# EAGLE design eled02 (EAGLE 7.2.0)
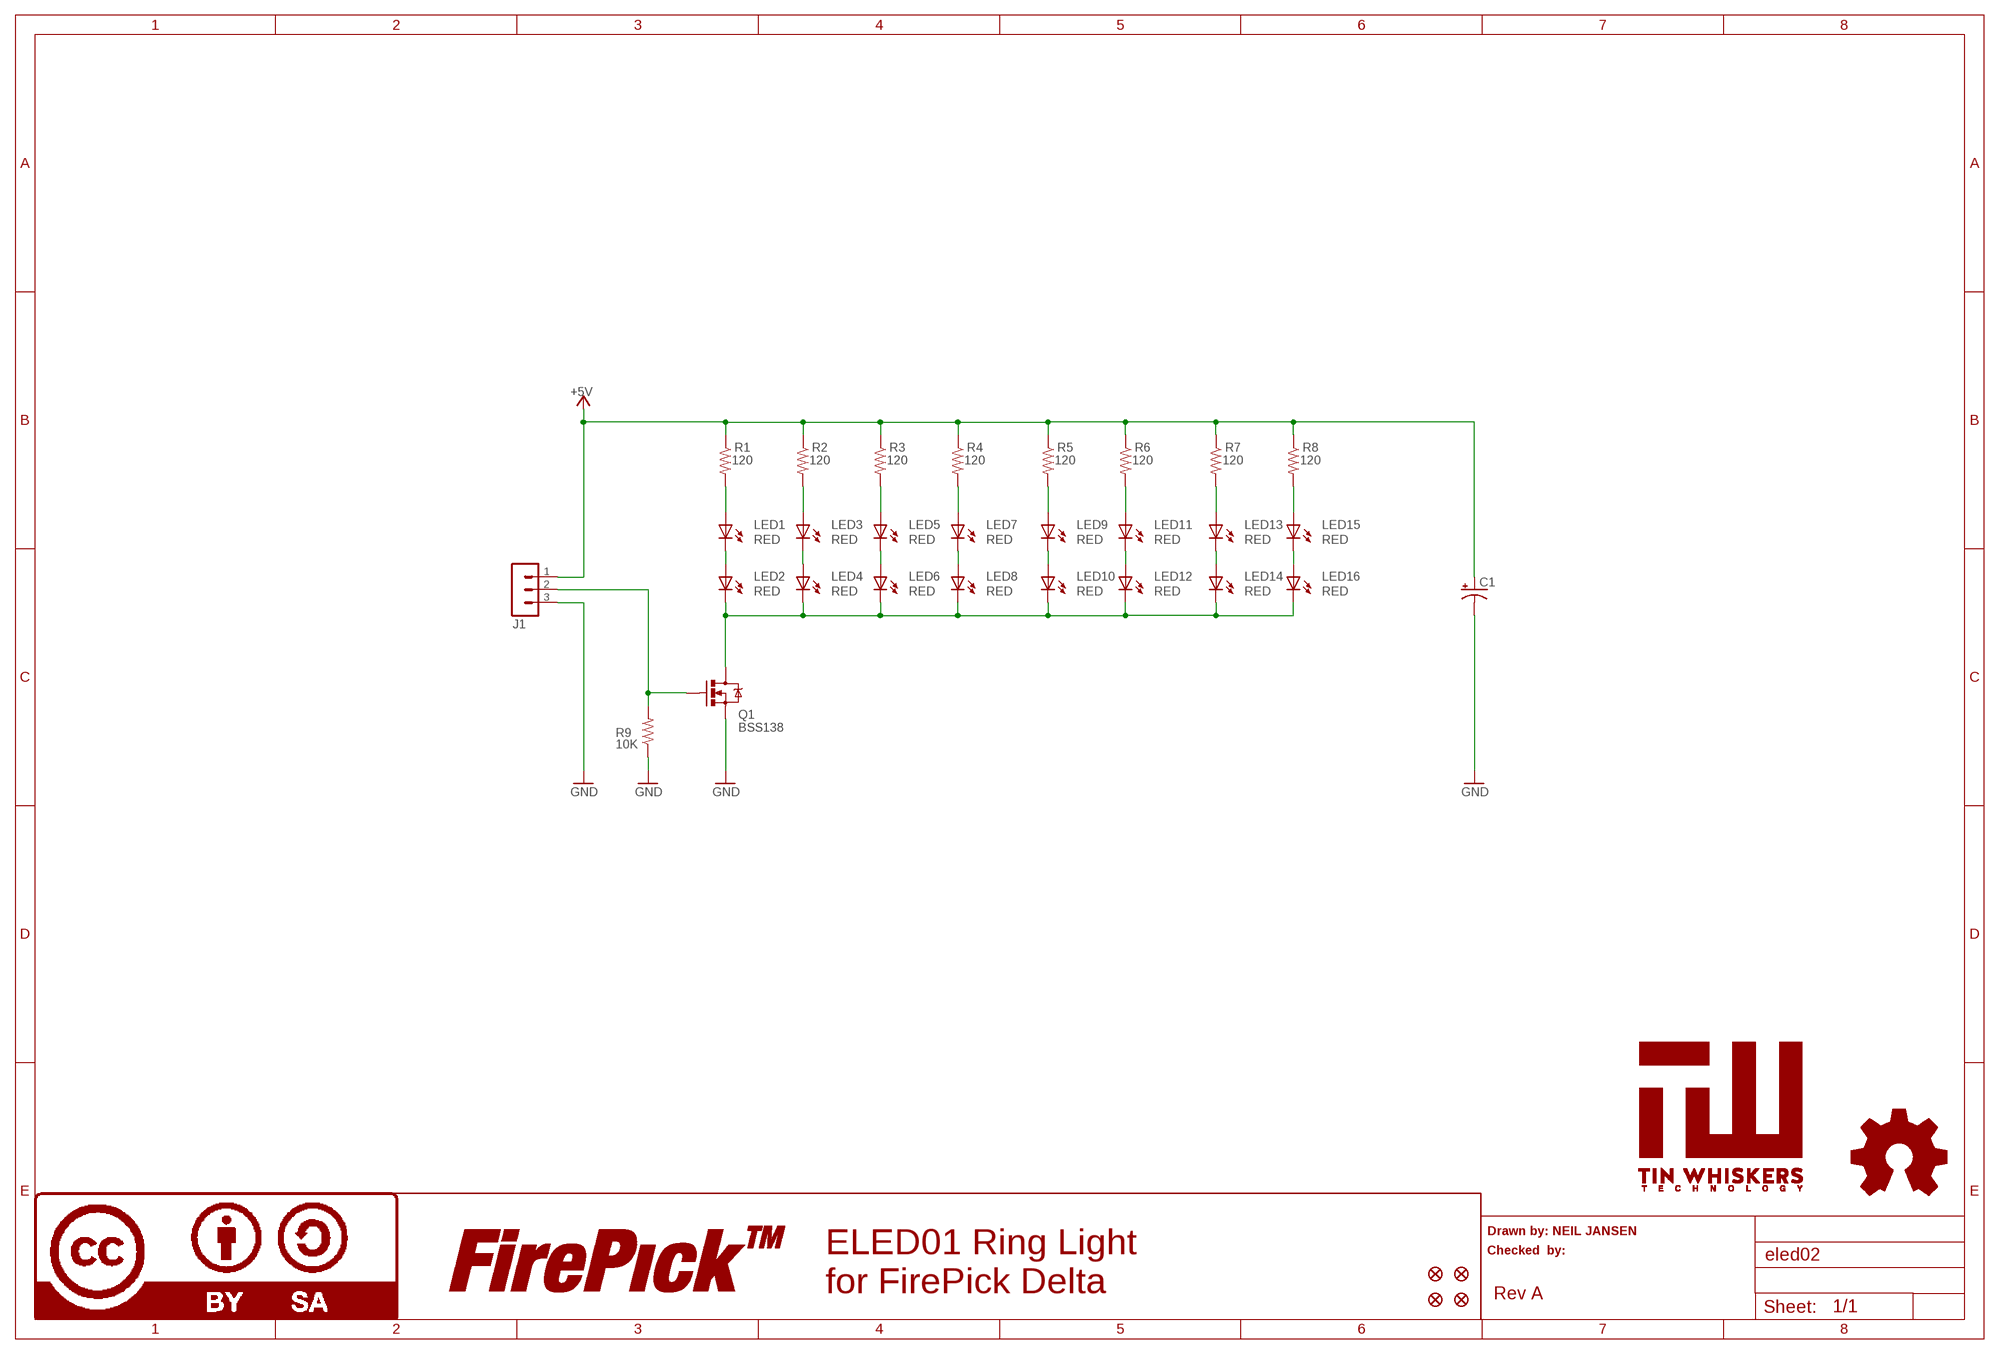
[diagram p0: schematic, sheet 1]

## Parts
C1  10UF-25V-20%(PTH)  [CPOL-RADIAL-10UF-25V]
FID1  FIDUCIAL1X2  [FIDUCIAL-1X2]
FID2  FIDUCIAL1X2  [FIDUCIAL-1X2]
FID3  FIDUCIAL1X2  [FIDUCIAL-1X2]
FID4  FIDUCIAL1X2  [FIDUCIAL-1X2]
J1  MA03-1  [MA03-1]
LED1  RED  LED1206-NS  [LED-1206-NO_SILK]
LED2  RED  LED1206-NS  [LED-1206-NO_SILK]
LED3  RED  LED1206-NS  [LED-1206-NO_SILK]
LED4  RED  LED1206-NS  [LED-1206-NO_SILK]
LED5  RED  LED1206-NS  [LED-1206-NO_SILK]
LED6  RED  LED1206-NS  [LED-1206-NO_SILK]
LED7  RED  LED1206-NS  [LED-1206-NO_SILK]
LED8  RED  LED1206-NS  [LED-1206-NO_SILK]
LED9  RED  LED1206-NS  [LED-1206-NO_SILK]
LED10  RED  LED1206-NS  [LED-1206-NO_SILK]
LED11  RED  LED1206-NS  [LED-1206-NO_SILK]
LED12  RED  LED1206-NS  [LED-1206-NO_SILK]
LED13  RED  LED1206-NS  [LED-1206-NO_SILK]
LED14  RED  LED1206-NS  [LED-1206-NO_SILK]
LED15  RED  LED1206-NS  [LED-1206-NO_SILK]
LED16  RED  LED1206-NS  [LED-1206-NO_SILK]
LOGO4  LOGO-FIREPICKMEDIUM  [LOGO-FIREPICK-MEDIUM]
LOGO5  LOGO-OSHWSMALL  [LOGO-OSHW-SMALL]
LOGO6  LOGO-CC-BY-SAMEDIUM  [LOGO-CC-BY-SA-MEDIUM]
Q1  BSS138  MOSFET-NCHANNELBSS138  [SOT23]
R1  120  RESISTOR0805-RES  [0805]
R2  120  RESISTOR0805-RES  [0805]
R3  120  RESISTOR0805-RES  [0805]
R4  120  RESISTOR0805-RES  [0805]
R5  120  RESISTOR0805-RES  [0805]
R6  120  RESISTOR0805-RES  [0805]
R7  120  RESISTOR0805-RES  [0805]
R8  120  RESISTOR0805-RES  [0805]
R9  10K  RESISTOR0805-RES  [0805]
U$1  TIN-WHISKERSSMALL  [TIN-WHISKERS-SMALL]

## Nets
+5V [power]: C1.1(+) J1.1 R1.1 R2.1 R3.1 R4.1 R5.1 R6.1 R7.1 R8.1
DRAIN: LED2.C LED4.C LED6.C LED8.C LED10.C LED12.C LED14.C LED16.C Q1.3(D)
ENABLE1: J1.2 Q1.1(G) R9.2
GND [power]: C1.2(-) J1.3 Q1.2(S) R9.1
N$1: LED1.C LED2.A
N$3: LED3.C LED4.A
N$4: LED7.C LED8.A
N$6: LED7.A R4.2
N$7: LED3.A R2.2
N$8: LED5.A R3.2
N$9: LED9.A R5.2
N$11: LED11.A R6.2
N$12: LED9.C LED10.A
N$13: LED5.C LED6.A
N$14: LED11.C LED12.A
N$17: LED13.C LED14.A
N$19: LED15.C LED16.A
N$20: LED13.A R7.2
N$21: LED15.A R8.2
N$22: LED1.A R1.2

## Notes on the sheet
- Drawn by: NEIL JANSEN
- Checked  by:
- ELED01 Ring Light
  for FirePick Delta
- Rev A

## Library data of the parts
C1 = SparkFun-Capacitors:10UF-25V-20%(PTH): CAP-08440; PROD_ID: CAP-08440
FID1-FID4 = SparkFun-Aesthetics:FIDUCIAL: Fiducial Alignment Points Various fiducial points for machine vision alignment.
J1 = !con-lstb:MA03-1: PIN HEADER; PARTNO: CONN-0.1-RA-1X3
LED1-LED16 = SparkFun-LED:LED: LEDs Standard schematic elements and footprints for 5mm, 3mm, 1206, and 0603 sized LEDs. 5mm - Spark Fun Electronics SKU : COM-00529 (and others); PARTNO: LTST-C150CKT
LOGO4 = FirePick:LOGO-FIREPICK; BOM: EXCLUDE; DNP: T
LOGO5 = FirePick:LOGO-OSHW; BOM: EXCLUDE; DNP: TRUE
LOGO6 = FirePick:LOGO-CC-BY-SA; BOM: EXCLUDE; DNP: T
Q1 = SparkFun-DiscreteSemi:MOSFET-NCHANNEL: Common NMOSFET Parts MFG P/N Store ID Prod ID FDD8780 TRANS-09984 SI7820DN TRANS-11055 FDS6630A IC-08089 2N7002PW TRANS-11151 FQP30N06L COM-10213 TRANS-10060 BSS123LT1G TRANS-08345 BSS138 TRANS-00830 BS170 2N7000; PARTNO: BSS138; PROD_ID: TRANS-00830
R1-R8 = SparkFun-Resistors:RESISTOR: Resistor Basic schematic elements and footprints for 0603, 1206, and PTH resistors.; PARTNO: RC0805FR-07120RL
R9 = SparkFun-Resistors:RESISTOR: Resistor Basic schematic elements and footprints for 0603, 1206, and PTH resistors.; PARTNO: RC0805FR-0710KL
U$1 = !tin-whiskers:TIN-WHISKERS

## Net classes
0 default: width 0.3 mm, drill 0.3 mm, clearance 0.3 mm
2 power-12V: width 0.3 mm, drill 0.3 mm, clearance 0.3 mm

## Board
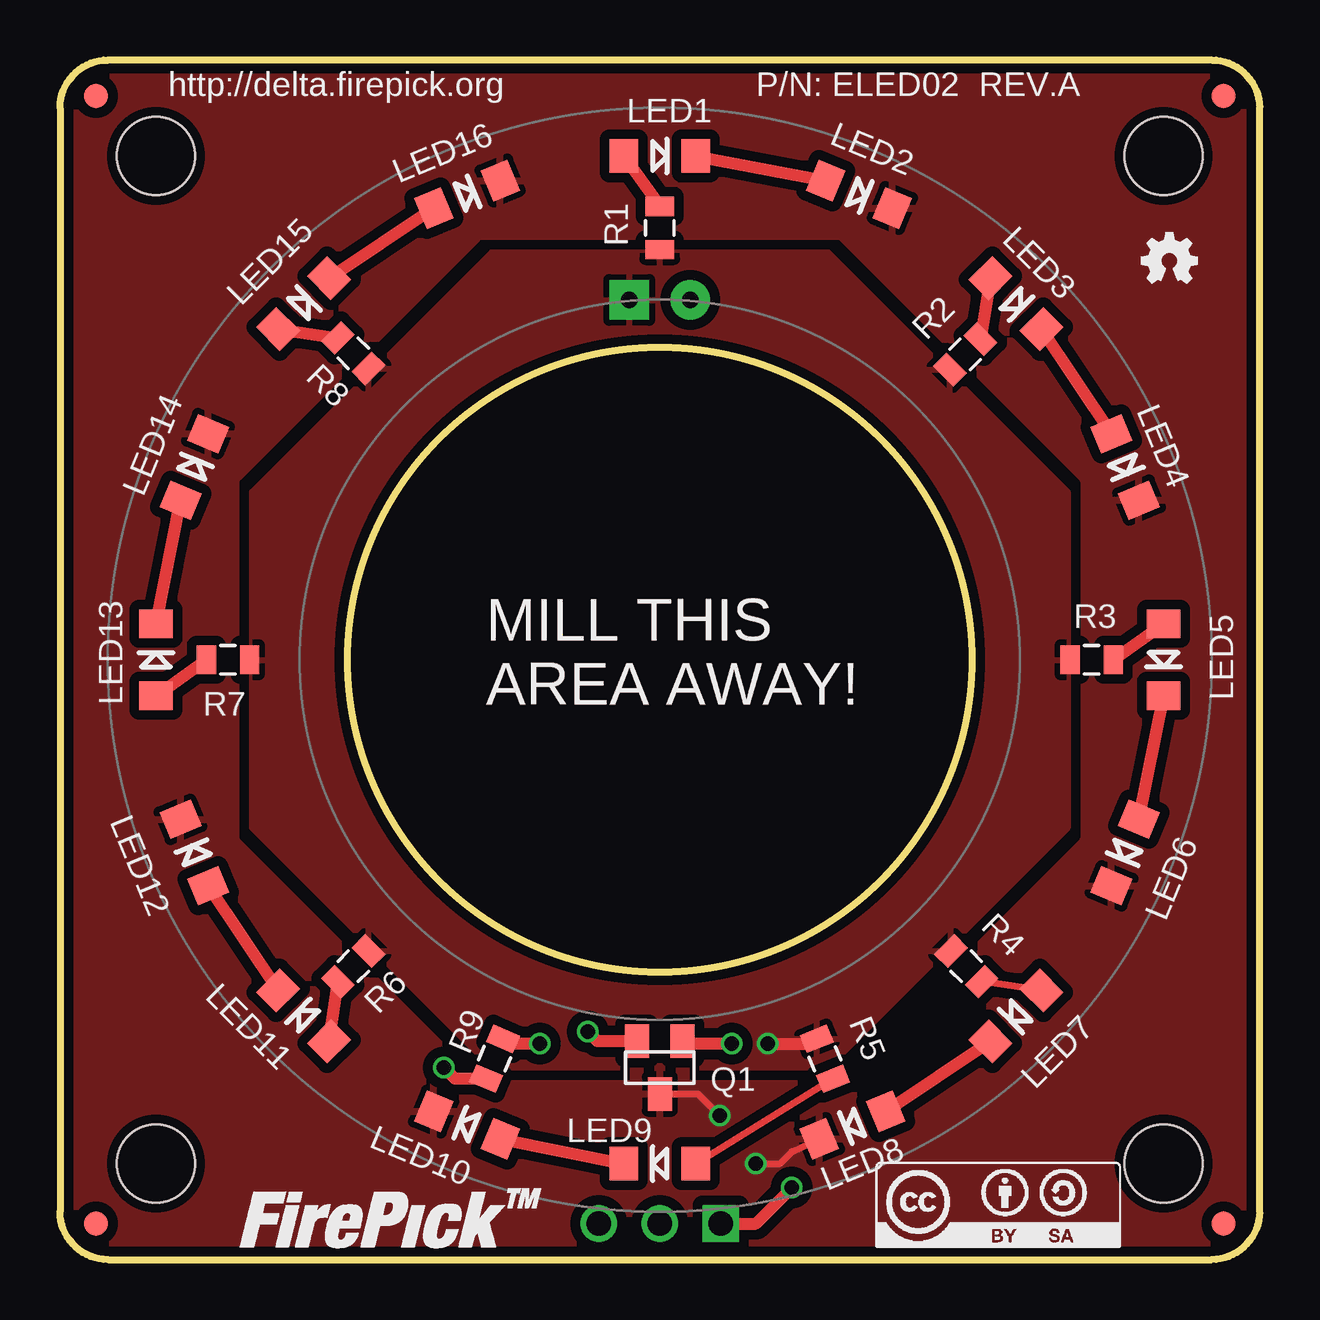
[diagram p1: board, top side]
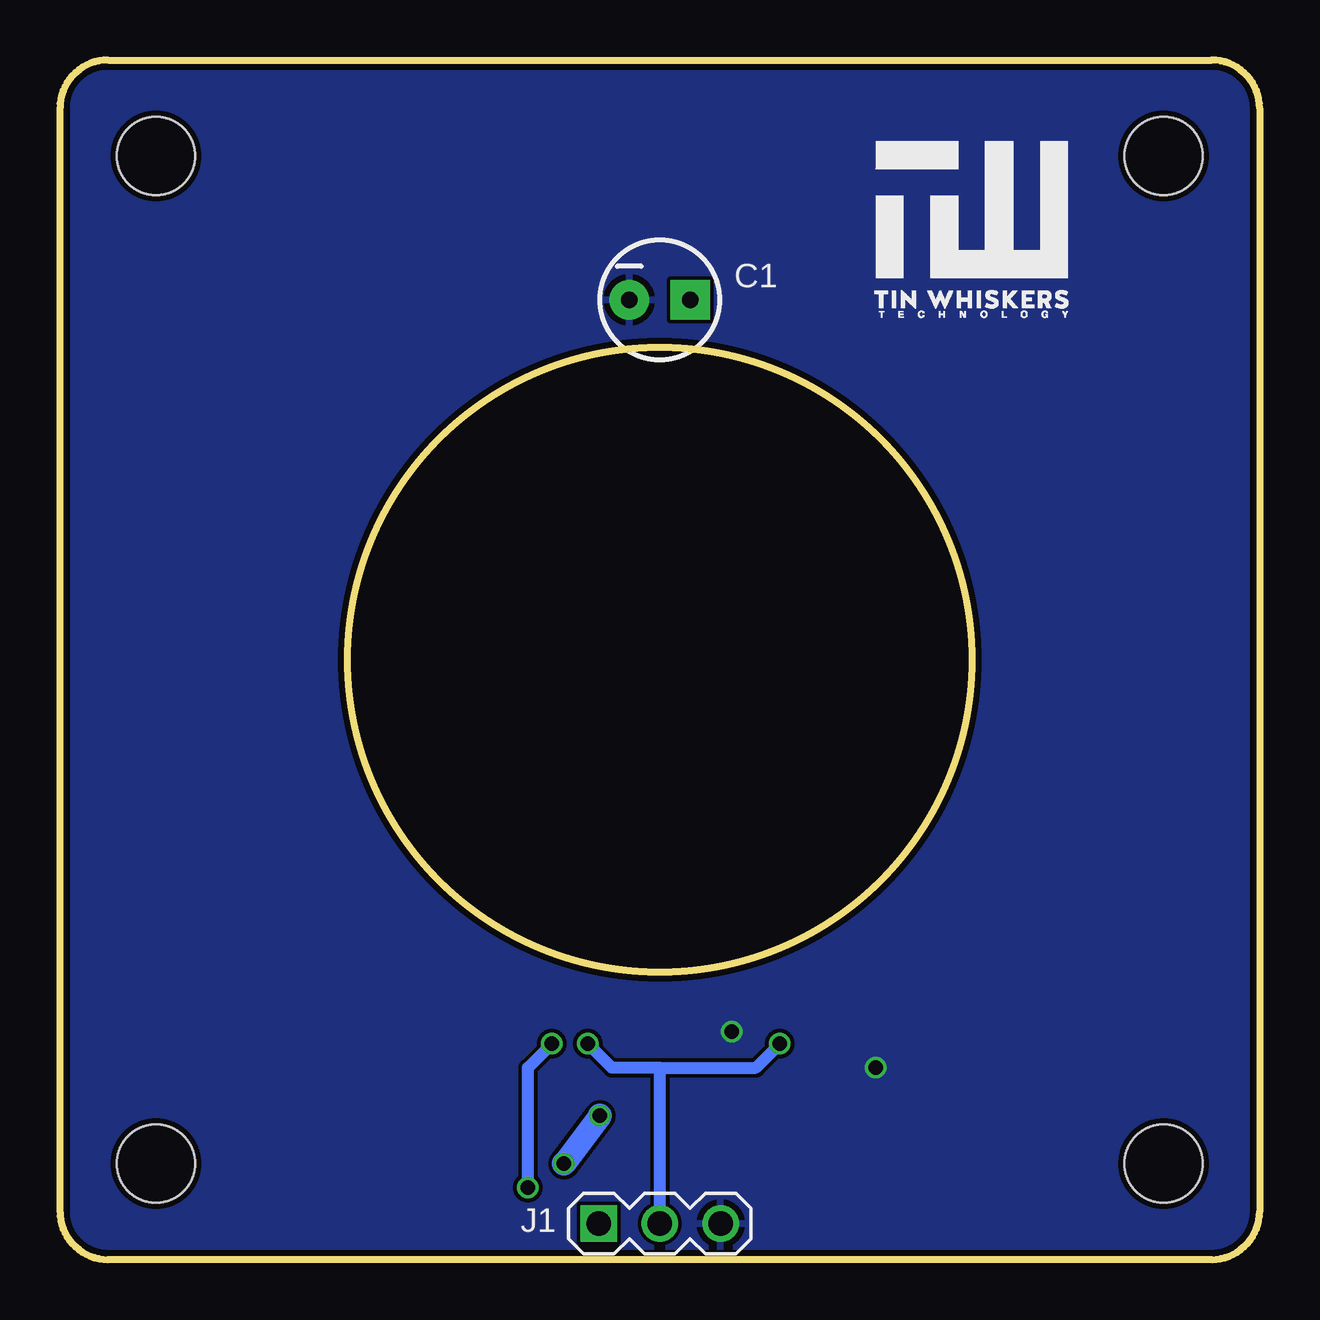
[diagram p2: board, bottom side, seen from below]

Size 50 x 50 mm. Coordinates in mm from the lower left corner, seen from the top.
Outline: 2,0 48,0 arc90 50,2 50,48 arc90 48,50 2,50 arc90 0,48 0,2 arc90 2,0
Outline: circle at 25,25 radius 13
Copper layers (1*16): Top 0.035mm / dielectric 1.5mm / Bottom 0.035mm
Design rules "SeeedStudio_2layer_DRU_no_angle_20140221": minimum track width 6mil, minimum drill 12mil, track to track 6mil, track to pad 6mil, pad to pad 6mil, via to via 6mil, smd to smd 0mil, copper to edge 10mil, drill to drill 10mil, minimum pad ring 10mil, minimum via ring 6mil, stop-mask expansion 2mil, vias tented up to drill 100mil, thermal gap 10mil
Holes 3.25 mm at 4,4 4,46 46,46 46,4

### Footprints (pad centres in the part's own frame; a part is rotated, then mirrored left to right if it is on the bottom)
CPOL-RADIAL-10UF-25V = drill 0.7 pad 1.651 square: 1 1.27,0 | drill 0.7 pad 1.651: 2 -1.27,0
FIDUCIAL-1X2 = smd 1 x 1: 1 0,0
MA03-1 = drill 1.016 square: 1 -2.54,0 | drill 1.016: 2 0,0; 3 2.54,0
LED-1206-NO_SILK = smd 1.2 x 1.4: A -1.5,0; C 1.5,0
SOT23 = smd 1 x 1.4: 1 -0.95,-1.1; 2 0.95,-1.1; 3 0,1.1
0805 = smd 0.8 x 1.2: 1 -0.9,0; 2 0.9,0

### Placement (x,y rotation side)
C1  25,40 0 bottom
FID1  1.5,48.5 0 top
FID2  48.5,1.5 0 top
FID3  1.5,1.5 0 top
FID4  48.5,48.5 0 top
J1  25,1.5 0 bottom
LED1  25,46 0 top
LED2  33.31,44.4 337.5 top
LED3  39.85,39.85 315 top
LED4  44.4,33.04 292.5 top
LED5  46,25 270 top
LED6  44.4,16.96 247.5 top
LED7  39.85,10.15 225 top
LED8  33.04,5.6 202.5 top
LED9  25,4 180 top
LED10  16.96,5.6 157.5 top
LED11  10.15,10.15 135 top
LED12  5.6,16.96 112.5 top
LED13  4,25 90 top
LED14  5.6,33.04 67.5 top
LED15  10.15,39.85 45 top
LED16  16.96,44.4 22.5 top
LOGO4  7.5,0.5 0 top
LOGO5  45,40.5 0 top
LOGO6  34,0.5 0 top
Q1  25,8 180 top
R1  25,43 90 top
R2  37.73,37.73 45 top
R3  43,25 0 top
R4  37.78,12.22 315 top
R5  31.89,8.37 292 top
R6  12.22,12.22 225 top
R7  7,25 180 top
R8  12.22,37.78 135 top
R9  18.11,8.37 67 top
U$1  16.5,39 0 bottom

### Tracks (layer width: path | path; a pad name or v marks a point on that pad's centre or on a via)
+5V  (via drill 0.6)
  Top 0.5: J1.1 29,1.5 v30.5,3 | v29.5,9 31.35,9 R5.1
  Bottom 0.5: v30.5,3 30.5,8 v29.5,9
  pour Top (isolate 0.406): 25,42 32,42 42,32 42,18 32,8 18,8 8,18 8,32 18,42
DRAIN  (via drill 0.6)
  Top 0.3: LED16.C 18,44.98 | LED2.C 35,43.83 | Q1.3 26.6,6.9 v27.5,6 | v29,4 30,4 30.5,4.5 LED8.C
  Bottom 1: v27.5,6 v29,4
  pour Top (isolate 0.406, rank 2): 0,50 50,50 50,0 0,0
ENABLE1  (via drill 0.6)
  Top 0.3: 26.05,9 Q1.1
  Top 0.5: v28,9 26.05,9 | v20,9 18.66,9 R9.2
  Bottom 0.5: J1.2 25,8 | 25,8 27,8 v28,9 | 25,8 21,8 v20,9
GND  (via drill 0.6)
  Top 0.5: Q1.2 22.4,9.1 v22,9.5 | R9.1 16.46,7.54 v16,8
  pour Bottom (rank 2): 0,50 50,50 50,0 0,0
N$1
  Top 0.5: LED1.C LED2.A
N$3
  Top 0.5: LED3.C LED4.A
N$4
  Top 0.5: LED8.A LED7.C
N$6
  Top 0.3: LED7.A R4.2
N$7
  Top 0.5: LED3.A R2.2
N$8
  Top 0.5: LED5.A R3.2
N$9
  Top 0.3: R5.2 LED9.A
N$11
  Top 0.5: LED11.A R6.2
N$12
  Top 0.5: LED10.A LED9.C
N$13
  Top 0.5: LED6.A LED5.C
N$14
  Top 0.5: LED12.A LED11.C
N$17
  Top 0.5: LED13.C LED14.A
N$19
  Top 0.5: LED15.C LED16.A
N$20
  Top 0.5: LED13.A R7.2
N$21
  Top 0.5: LED15.A R8.2
N$22
  Top 0.5: LED1.A R1.2

### Text on the board
tPlace: http://delta.firepick.org | P/N: ELED02 REV.A | MILL THIS / AREA AWAY!